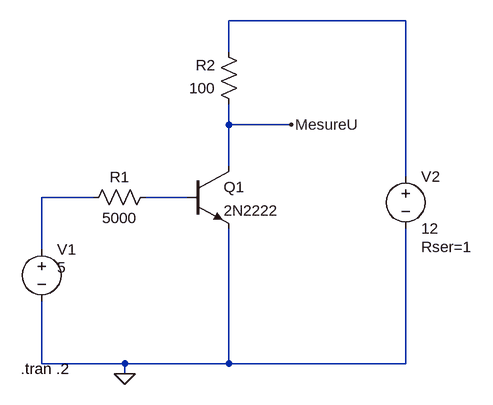
[diagram p0: schematic Npn.asc]
Npn.asc, the LTspice schematic file:
Version 4
SHEET 1 880 680
WIRE -176 16 -448 16
WIRE -448 64 -448 16
WIRE -448 176 -448 144
WIRE -352 176 -448 176
WIRE -448 240 -448 176
WIRE -176 256 -176 16
WIRE -656 288 -736 288
WIRE -512 288 -576 288
WIRE -736 368 -736 288
WIRE -736 544 -736 448
WIRE -608 544 -736 544
WIRE -448 544 -448 336
WIRE -448 544 -608 544
WIRE -176 544 -176 336
WIRE -176 544 -448 544
WIRE -608 560 -608 544
FLAG -608 560 0
FLAG -352 176 MesureU
SYMBOL res -560 272 R90
WINDOW 0 0 56 VBottom 2
WINDOW 3 32 56 VTop 2
SYMATTR InstName R1
SYMATTR Value 5000
SYMBOL voltage -736 352 R0
WINDOW 123 0 0 Left 2
WINDOW 39 24 124 Left 2
WINDOW 3 24 44 Left 2
SYMATTR InstName V1
SYMATTR Value 5
SYMBOL npn -512 240 R0
SYMATTR InstName Q1
SYMATTR Value 2N2222
SYMBOL res -432 160 R180
WINDOW 0 36 76 Left 2
WINDOW 3 36 40 Left 2
SYMATTR InstName R2
SYMATTR Value 100
SYMBOL voltage -176 240 R0
WINDOW 123 0 0 Left 2
WINDOW 39 24 124 Left 2
SYMATTR SpiceLine Rser=1
SYMATTR InstName V2
SYMATTR Value 12
TEXT -768 552 Left 2 !.tran .2

The netlist it stands for:
* Npn.asc
R1 N003 N002 5000
V1 N002 0 5
Q1 MesureU N003 0 0 2N2222
R2 MesureU N001 100
V2 N001 0 12 Rser=1
.model NPN NPN
.model PNP PNP
.lib standard.bjt
.tran .2
.backanno
.end